# Altium schematic sheet SH2-CONTROLS.SchDoc: SH2-CONTROLS
size Letter; DrawnBy: Qinyang Bao; SheetNumber: 2; SheetTotal: 4
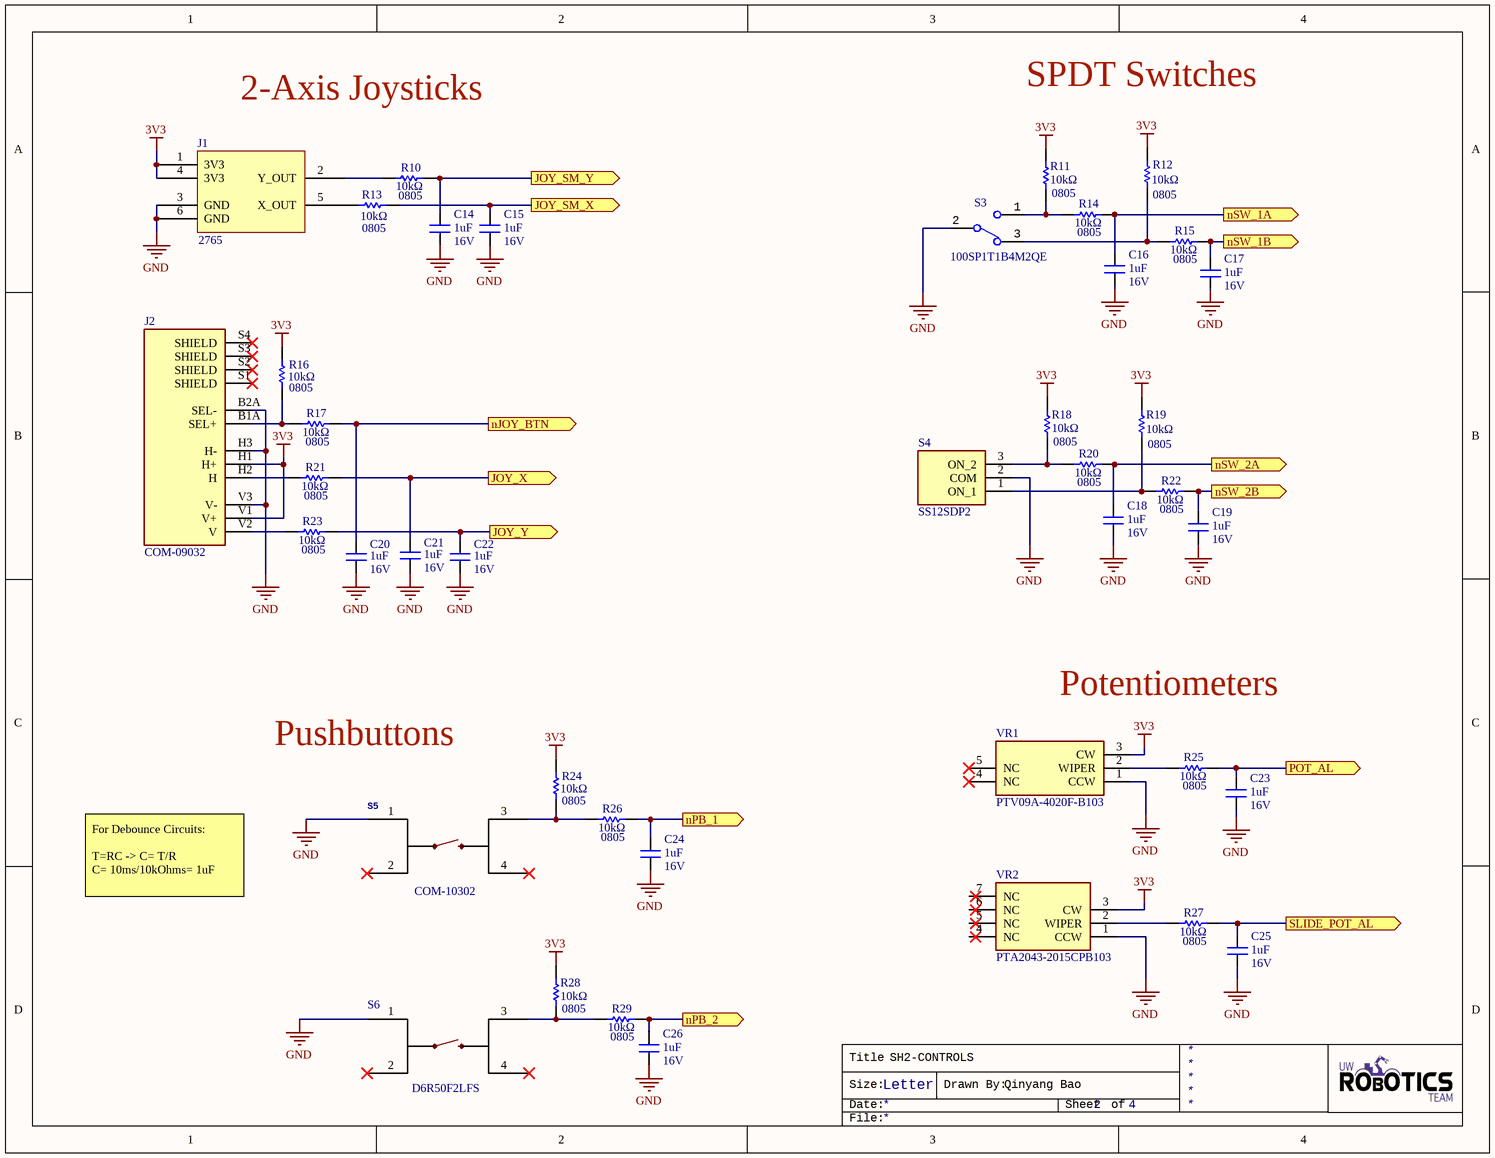
[diagram p0: SH2-CONTROLS.SchDoc]

## Parts
C14  value 1uF  Voltage Rating: 16V  [CAPC2012X140N]  (hidden comment: CAP_1uF_16V_0805)
C15  value 1uF  Voltage Rating: 16V  [CAPC2012X140N]  (hidden comment: CAP_1uF_16V_0805)
C16  value 1uF  Voltage Rating: 16V  [CAPC2012X140N]  (hidden comment: CAP_1uF_16V_0805)
C17  value 1uF  Voltage Rating: 16V  [CAPC2012X140N]  (hidden comment: CAP_1uF_16V_0805)
C18  value 1uF  Voltage Rating: 16V  [CAPC2012X140N]  (hidden comment: CAP_1uF_16V_0805)
C19  value 1uF  Voltage Rating: 16V  [CAPC2012X140N]  (hidden comment: CAP_1uF_16V_0805)
C20  value 1uF  Voltage Rating: 16V  [CAPC2012X140N]  (hidden comment: CAP_1uF_16V_0805)
C21  value 1uF  Voltage Rating: 16V  [CAPC2012X140N]  (hidden comment: CAP_1uF_16V_0805)
C22  value 1uF  Voltage Rating: 16V  [CAPC2012X140N]  (hidden comment: CAP_1uF_16V_0805)
C23  value 1uF  Voltage Rating: 16V  [CAPC2012X140N]  (hidden comment: CAP_1uF_16V_0805)
C24  value 1uF  Voltage Rating: 16V  [CAPC2012X140N]  (hidden comment: CAP_1uF_16V_0805)
C25  value 1uF  Voltage Rating: 16V  [CAPC2012X140N]  (hidden comment: CAP_1uF_16V_0805)
C26  value 1uF  Voltage Rating: 16V  [CAPC2012X140N]  (hidden comment: CAP_1uF_16V_0805)
J1  Manufacturer Part Number 1: 2765  [2_AXIS_JOY_SMALL]  (hidden comment: 2_AXIS_JOYSTICK_SMALL)
J2  Manufacturer Part Number 1: COM-09032  [2_AXIS_JOY]  (hidden comment: 2_AXIS_JOYSTICK)
R10  value 10kΩ  Case Code (Imperial): 0805  [RESC2012X60N]  (hidden comment: RES_10kΩ_0805)
R11  value 10kΩ  Case Code (Imperial): 0805  [RESC2012X60N]  (hidden comment: RES_10kΩ_0805)
R12  value 10kΩ  Case Code (Imperial): 0805  [RESC2012X60N]  (hidden comment: RES_10kΩ_0805)
R13  value 10kΩ  Case Code (Imperial): 0805  [RESC2012X60N]  (hidden comment: RES_10kΩ_0805)
R14  value 10kΩ  Case Code (Imperial): 0805  [RESC2012X60N]  (hidden comment: RES_10kΩ_0805)
R15  value 10kΩ  Case Code (Imperial): 0805  [RESC2012X60N]  (hidden comment: RES_10kΩ_0805)
R16  value 10kΩ  Case Code (Imperial): 0805  [RESC2012X60N]  (hidden comment: RES_10kΩ_0805)
R17  value 10kΩ  Case Code (Imperial): 0805  [RESC2012X60N]  (hidden comment: RES_10kΩ_0805)
R18  value 10kΩ  Case Code (Imperial): 0805  [RESC2012X60N]  (hidden comment: RES_10kΩ_0805)
R19  value 10kΩ  Case Code (Imperial): 0805  [RESC2012X60N]  (hidden comment: RES_10kΩ_0805)
R20  value 10kΩ  Case Code (Imperial): 0805  [RESC2012X60N]  (hidden comment: RES_10kΩ_0805)
R21  value 10kΩ  Case Code (Imperial): 0805  [RESC2012X60N]  (hidden comment: RES_10kΩ_0805)
R22  value 10kΩ  Case Code (Imperial): 0805  [RESC2012X60N]  (hidden comment: RES_10kΩ_0805)
R23  value 10kΩ  Case Code (Imperial): 0805  [RESC2012X60N]  (hidden comment: RES_10kΩ_0805)
R24  value 10kΩ  Case Code (Imperial): 0805  [RESC2012X60N]  (hidden comment: RES_10kΩ_0805)
R25  value 10kΩ  Case Code (Imperial): 0805  [RESC2012X60N]  (hidden comment: RES_10kΩ_0805)
R26  value 10kΩ  Case Code (Imperial): 0805  [RESC2012X60N]  (hidden comment: RES_10kΩ_0805)
R27  value 10kΩ  Case Code (Imperial): 0805  [RESC2012X60N]  (hidden comment: RES_10kΩ_0805)
R28  value 10kΩ  Case Code (Imperial): 0805  [RESC2012X60N]  (hidden comment: RES_10kΩ_0805)
R29  value 10kΩ  Case Code (Imperial): 0805  [RESC2012X60N]  (hidden comment: RES_10kΩ_0805)
S3  SW_SPDT  [100SP1T1B4M2QE]  (value not drawn)
S4  SW_SPDT_SMALL  [SS12SDP2]  (value not drawn)
S5  Manufacturer Part Number 1: COM-10302  [TACTILE_SWITCH_PTH_12MM]  (hidden comment: Pushbutton)
S6  Manufacturer Part Number 1: D6R50F2LFS  [D6R]  (hidden comment: MOMENTARY_SWITCH_D6R)
VR1  Manufacturer Part Number 1: PTV09A-4020F-B103  [PTV09A4020FB103]  (hidden comment: POT_10K)
VR2  Manufacturer Part Number 1: PTA2043-2015CPB103  [PTA20432015CPB103]  (hidden comment: POT_10K_SLIDE)

## Ports
JOY_SM_X (out), JOY_SM_Y (out), JOY_X (out), JOY_Y (out), nJOY_BTN (out), nPB_1 (out), nPB_2 (out), nSW_1A (out), nSW_1B (out), nSW_2A (out), nSW_2B (out), POT_AL (out), SLIDE_POT_AL (out)

## Nets
3V3: J1.1(3V3) J1.4(3V3) J2.H1(H+) J2.V1(V+) R11.1 R12.1 R16.1 R18.1 R19.1 R24.1 R28.1 VR1.3(CW) VR2.3(CW)
GND: C14.1 C15.1 C16.1 C17.1 C18.1 C19.1 C20.1 C21.1 C22.1 C23.1 C24.1 C25.1 C26.1 J1.3(GND) J1.6(GND) J2.B2A(SEL-) J2.H3(H-) J2.V3(V-) S3.2 S4.2(COM) S5.1 S6.1 VR1.1(CCW) VR2.1(CCW)
JOY_SM_X: C15.2 R13.2 ; port JOY_SM_X
JOY_SM_Y: C14.2 R10.2 ; port JOY_SM_Y
JOY_X: C21.2 R21.2 ; port JOY_X
JOY_Y: C22.2 R23.2 ; port JOY_Y
nJOY_BTN: C20.2 R17.2 ; port nJOY_BTN
nPB_1: C24.2 R26.2 ; port nPB_1
nPB_2: C26.2 R29.2 ; port nPB_2
nSW_1A: C16.2 R14.2 ; port nSW_1A
nSW_1B: C17.2 R15.2 ; port nSW_1B
nSW_2A: C18.2 R20.2 ; port nSW_2A
nSW_2B: C19.2 R22.2 ; port nSW_2B
POT_AL: C23.2 R25.2 ; port POT_AL
SLIDE_POT_AL: C25.2 R27.2 ; port SLIDE_POT_AL
NetJ1_2: J1.2(Y_OUT) R10.1
NetJ1_5: J1.5(X_OUT) R13.1
NetJ2_B1A: J2.B1A(SEL+) R16.2 R17.1
NetJ2_H2: J2.H2(H) R21.1
NetJ2_V2: J2.V2(V) R23.1
NetR11_2: R11.2 R14.1 S3.1
NetR12_2: R12.2 R15.1 S3.3
NetR18_2: R18.2 R20.1 S4.3(ON_2)
NetR19_2: R19.2 R22.1 S4.1(ON_1)
NetR24_2: R24.2 R26.1 S5.3
NetR25_1: R25.1 VR1.2(WIPER)
NetR27_1: R27.1 VR2.2(WIPER)
NetR28_2: R28.2 R29.1 S6.3

Not connected (* = marked no-connect by the designer): J2 S1(SHIELD)* S2(SHIELD)* S3(SHIELD)* S4(SHIELD)*; S5 2* 4*; S6 2* 4*; VR1 4(NC)* 5(NC)*; VR2 4(NC) 5(NC) 6(NC) 7(NC)

## Notes on the sheet
- SPDT Switches
- 2-Axis Joysticks
- Potentiometers
- Pushbuttons
- For Debounce Circuits:
  T=RC -> C= T/R
  C= 10ms/10kOhms= 1uF
- Title
- Size:
- Date:
- Letter
- Drawn By:
- Sheet
- of
- File:

## Library data of the parts
C14-C26 = CAP_1uF_16V_0805: CAP CER 1UF 16V X7R 0805; Manufacturer 1: Yageo; Manufacturer Part Number 1: CC0805KKX7R7BB105; Tolerance: 10%; Mount: Surface Mount; Case Code (Metric): 2012; Case Code (Imperial): 0805; Min Operating Temperature: -55°C; Max Operating Temperature: 125°C; Dielectric: X7R; Termination: SMD/SMT; Supplier 1: Digi-Key; Supplier Part Number 1: 311-1365-1-ND; Package: 0805 (2012 Metric)
J1 = 2_AXIS_JOYSTICK_SMALL: JOYSTICK 10K OHM 2 AXIS TH; Manufacturer 1: Adafruit Industries; Resistance: 10kR; Supplier 1: Digi-Key; Stock 1: 351; Pricing 1: 1=2.50000 (USD); RoHS: Yes; Mount: Through Hole; Packaging: Bulk; Length: 0.707inch; Height: 0.472inch; Width: 0.697inch; ComponentLink1URL: https://media.digikey.com/pdf/Data%20Sheets/Adafruit%20PDFs/2765_Web.pdf?src-supplier=Digi-Key; ComponentLink1Description: https://media.digikey.com/pdf/Data%20Sheets/Adafruit%20PDFs/2765_Web.pdf?src-supplier=Digi-Key; Supplier Part Number 1: 1528-1730-ND
J2 = 2_AXIS_JOYSTICK: JOYSTICK 10K OHM 2 AXIS TH; Manufacturer 1: SparkFun; Supplier 1: Digi-Key; Stock 1: 1039; Pricing 1: 1=3.95000 (USD); RoHS: No; ComponentLink1URL: https://media.digikey.com/pdf/Data%20Sheets/Sparkfun%20PDFs/COM-09032_Web.pdf?src-supplier=Digi-Key; ComponentLink1Description: https://media.digikey.com/pdf/Data%20Sheets/Sparkfun%20PDFs/COM-09032_Web.pdf?src-supplier=Digi-Key; Supplier Part Number 1: 1568-1526-ND
R10-R29 = RES_10kΩ_0805: RES SMD 10K OHM 1% 1/8W 0805; Manufacturer 1: Yageo; Manufacturer Part Number 1: RC0805FR-0710KL; Power Rating: 125mW; Supplier 1: Digi-Key; Case Code (Metric): 2012; Min Operating Temperature: -55°C; Max Operating Temperature: 155°C; Resistance: 10K; Tolerance: 1%; Termination: SMD/SMT; Supplier Part Number 1: 311-10.0KCRCT-ND; Package: 0805 (2012 Metric)
S3 = SW_SPDT: SWITCH TOGGLE SPDT 5A 120V; Manufacturer 1: E-Switch; Actuator Material: Brass,Chrome; Switch Function: On-On; Voltage Rating (DC): 28V; Illumination Type: Non-Illuminated,Illuminated; Actuator Type: Standard Round; Electrical Life: 40000Cycles; Actuator Length: 12.19mm; ComponentLink1URL: https://datasheet.ciiva.com/24455/t111597-24455739.pdf?src-supplier=Onlinecomponents.com; ComponentLink1Description: https://datasheet.ciiva.com/24455/t111597-24455739.pdf?src-supplier=Onlinecomponents.com; ComponentLink2URL: https://datasheet.ciiva.com/2905/t111597-2905494.pdf?src-supplier=Digi-Key; ComponentLink2Description: https://datasheet.ciiva.com/2905/t111597-2905494.pdf?src-supplier=Digi-Key; Supplier 1: Digi-Key; Manufacturer Part Number 1: 100SP1T1B4M2QE; Stock 1: 4845; Pricing 1: 1=1.99000, 10=1.77900, 25=1.68240, 50=1.60200, 100=1.52950, 250=1.46512, 500=1.36850, 1000=1.30410 (USD); RoHS: Yes; Mount: Through Hole; Contact Material: Silver; Contact Plating: Silver; Min Operating Temperature: -30°C; Max Operating Temperature: 85°C; Package Quantity: 1; Current Rating: 5A; Voltage Rating (AC): 120V; Packaging: Bulk; Orientation: Vertical; Termination: PC Pin; Throw Configuration: SPDT; Lead Free: Lead Free; Supplier Part Number 1: EG2355-ND
S4 = SW_SPDT_SMALL: SWITCH SLIDE SPDT 100MA 30V; Manufacturer 1: NKK Switches; Actuator Material: Polyamide,Polyacetal; Mechanical Life: 10000Cycles; Switch Travel: 2mm; Illumination Type: Non-Illuminated; Switch Function: On-On; Voltage Rating (AC): 28V; Insulation Resistance: 100MR; Contact Resistance: 20mR; Number of Positions: 2; Actuator Type: Standard; Number of Poles: 1; Supplier 1: Digi-Key; Manufacturer Part Number 1: SS12SDP2; Stock 1: 4905; Pricing 1: 1=1.56000, 10=1.50000, 25=1.41000, 100=1.21800, 250=1.11000, 500=1.03200, 1000=0.96000, 2500=0.87000, 5000=0.81000 (USD); RoHS: Yes; Mount: PCB,Through Hole; Contact Material: Brass,Silver,Bronze; Contact Plating: Silver; Housing Material: Thermoplastic; Body Material: Polyamide,Polyacetal; Min Operating Temperature: -15°C; Max Operating Temperature: 60°C; Throw Configuration: SPDT; Packaging: Tray; Orientation: Straight; Termination: PC Pins; Voltage Rating (DC): 30V; Electrical Life: 10000Cycles; Current Rating: 100mA; Contact Current Rating: 100mA; Package Quantity: 1; Max Current Rating: 100mA; Max Voltage Rating (DC): 30V; Length: 10.2mm; Height: 6.5mm; Actuator Length: 2mm; Depth: 4mm; Lead Free: Lead Free; REACH SVHC: No SVHC; Flammability Rating: UL94 V-0; ComponentLink1URL: https://datasheet.ciiva.com/19453/1915771-19453348.pdf?src-supplier=Jameco; ComponentLink1Description: https://datasheet.ciiva.com/19453/1915771-19453348.pdf?src-supplier=Jameco; ComponentLink2URL: https://datasheet.ciiva.com/29119/704240-da-01-en-schiebes-spdt-on-on-2x2-oben-bet-silb-29119647.pdf?src-supplier=Conrad; ComponentLink2Description: https://datasheet.ciiva.com/29119/704240-da-01-en-schiebes-spdt-on-on-2x2-oben-bet-silb-29119647.pdf?src-supplier=Conrad; ComponentLink3URL: https://datasheet.ciiva.com/1532/10312-1532339.pdf?src-supplier=Element14; ComponentLink3Description: https://datasheet.ciiva.com/1532/10312-1532339.pdf?src-supplier=Element14; ComponentLink4URL: https://datasheet.ciiva.com/16394/ssnonilluminated-16394655.pdf?src-supplier=Future+Electronics; ComponentLink4Description: https://datasheet.ciiva.com/16394/ssnonilluminated-16394655.pdf?src-supplier=Future+Electronics; Supplier Part Number 1: 360-2133-ND
S5 = MOMENTARY_SWITCH_TH: Momentary Switch (Pushbutton) - SPST; Manufacturer 1: SparkFun; SymbolName_1: SWITCH-MOMENTARY-2; PROD_ID: SWCH-09185; SF_SKU: COM-09190; Package: TACTILE_SWITCH_PTH_12MM; Supplier 1: Digi-Key; Stock 1: 32; Pricing 1: 1=5.85000 (USD); RoHS: No; Mount: Through Hole; Throw Configuration: SPST; Termination: PC Pin; ComponentLink1URL: https://www.sparkfun.com/datasheets/Components/Buttons/TSA12110%20TACT%20SWITCH.jpg?src-supplier=Digi-Key; ComponentLink1Description: https://www.sparkfun.com/datasheets/Components/Buttons/TSA12110%20TACT%20SWITCH.jpg?src-supplier=Digi-Key; Supplier Part Number 1: 1568-1332-ND
S6 = MOMENTARY_SWITCH_D6R: SWITCH PUSH SPST-NO 0.1A 32V; Manufacturer 1: ITT C&K; Current Rating: 100mA; Throw Configuration: SPST; Operating Force: 2.5N; Actuator Type: Round, Button; Switch Function: Off-Mom; Electrical Life: 250000Cycles; Actuator Length: 7mm; Row Spacing: 5mm; Supplier 1: Digi-Key; Stock 1: 4683; Pricing 1: 1=1.10000, 10=0.98000, 25=0.93080, 50=0.88520, 100=0.84370, 250=0.80652, 500=0.72380, 1000=0.68244 (USD); RoHS: Yes; Mount: Through Hole; Contact Plating: Silver; Number of Terminals: 4; Min Operating Temperature: -20°C; Max Operating Temperature: 85°C; Max Voltage Rating (DC): 32V; Packaging: Bulk; Package Quantity: 2500; Voltage Rating (DC): 32V; Max Current Rating: 100mA; Orientation: Straight; Termination: PC Pin; Diameter: 12mm; Terminal Pitch: 5mm; Lead Free: Lead Free; ComponentLink1URL: https://datasheet.ciiva.com/2869/d6-31aug10-2869553.pdf?src-supplier=Digi-Key; ComponentLink1Description: https://datasheet.ciiva.com/2869/d6-31aug10-2869553.pdf?src-supplier=Digi-Key; ComponentLink2URL: https://datasheet.ciiva.com/12449/d6-31aug10-19155-12449292.pdf?src-supplier=Mouser; ComponentLink2Description: https://datasheet.ciiva.com/12449/d6-31aug10-19155-12449292.pdf?src-supplier=Mouser; ComponentLink3URL: https://datasheet.ciiva.com/16156/d6-4feb-16156540.pdf?src-supplier=Onlinecomponents.com; ComponentLink3Description: https://datasheet.ciiva.com/16156/d6-4feb-16156540.pdf?src-supplier=Onlinecomponents.com; Supplier Part Number 1: 401-1993-ND
VR1 = POT_10K: POT 10K OHM 1/20W CARBON LINEAR; Manufacturer 1: Bourns; Number of Turns: 1; Max Power Dissipation: 50mW; Resistance: 10kR; Tolerance: 20%; Voltage Rating (DC): 20V; Actuator Length: 0.787inch; Actuator Diameter: 0.236inch; ComponentLink1URL: https://datasheet.ciiva.com/6249/ptv09-6249579.pdf?src-supplier=Digi-Key; ComponentLink1Description: https://datasheet.ciiva.com/6249/ptv09-6249579.pdf?src-supplier=Digi-Key; Supplier 1: Digi-Key; Stock 1: 629; Pricing 1: 1=0.83000, 10=0.74400, 25=0.67200, 50=0.64800, 100=0.61200, 250=0.58800, 500=0.55200, 1000=0.45600, 5000=0.37200 (USD); RoHS: Yes; Mount: Through Hole,Snap in,Brackets; Min Operating Temperature: -10°C; Max Operating Temperature: 50°C; Taper: Linear; Termination: Pin; Number of Gangs: 1; Military Standard: Not; Composition: Carbon; Type: Potentiometer; Packaging: Bulk; Power Rating: 50mW; Package Quantity: 100; Voltage Rating: 20V; Length: 11.4mm; Depth: 12.5mm; Radiation Hardening: No; REACH SVHC: No SVHC; ComponentLink2URL: https://datasheet.ciiva.com/11831/0900766b80fa58ec-11831036.pdf?src-supplier=RSComponents; ComponentLink2Description: https://datasheet.ciiva.com/11831/0900766b80fa58ec-11831036.pdf?src-supplier=RSComponents; ComponentLink3URL: https://datasheet.ciiva.com/6249/ptv09-6249723.pdf?src-supplier=Digi-Key; ComponentLink3Description: https://datasheet.ciiva.com/6249/ptv09-6249723.pdf?src-supplier=Digi-Key; ComponentLink4URL: https://datasheet.ciiva.com/30228/24ptv09-30228045.pdf?src-supplier=Onlinecomponents.com; ComponentLink4Description: https://datasheet.ciiva.com/30228/24ptv09-30228045.pdf?src-supplier=Onlinecomponents.com; Supplier Part Number 1: PTV09A-4020F-B103-ND
VR2 = POT_10K_SLIDE: SLIDE POT 10K OHM 0.1W TOP 20MM; Manufacturer 1: Bourns; Max Power Dissipation: 100mW; Tolerance: 20%; Resistance: 10kR; Supplier 1: Digi-Key; Stock 1: 2296; Pricing 1: 1=1.29000, 10=1.14000, 25=1.02600, 50=0.98800, 100=0.95000, 250=0.89300, 500=0.76000, 1000=0.70300, 5000=0.57760 (USD); RoHS: Yes; Mount: Through Hole; Min Operating Temperature: -10°C; Max Operating Temperature: 50°C; Packaging: Tray; Composition: Potentiometer; Type: Potentiometer; Termination: Pin; Taper: Linear; Military Standard: Not; Package Quantity: 100; Power Rating: 100mW; Length: 1.378inch; Height: 0.256inch; Width: 0.354inch; Depth: 9mm; REACH SVHC: No SVHC; ComponentLink1URL: https://datasheet.ciiva.com/6248/pta-6248474.pdf?src-supplier=Digi-Key; ComponentLink1Description: https://datasheet.ciiva.com/6248/pta-6248474.pdf?src-supplier=Digi-Key; Supplier Part Number 1: PTA2043-2015CPB103-ND